# EAGLE design T4p0 (EAGLE 9.6.2)
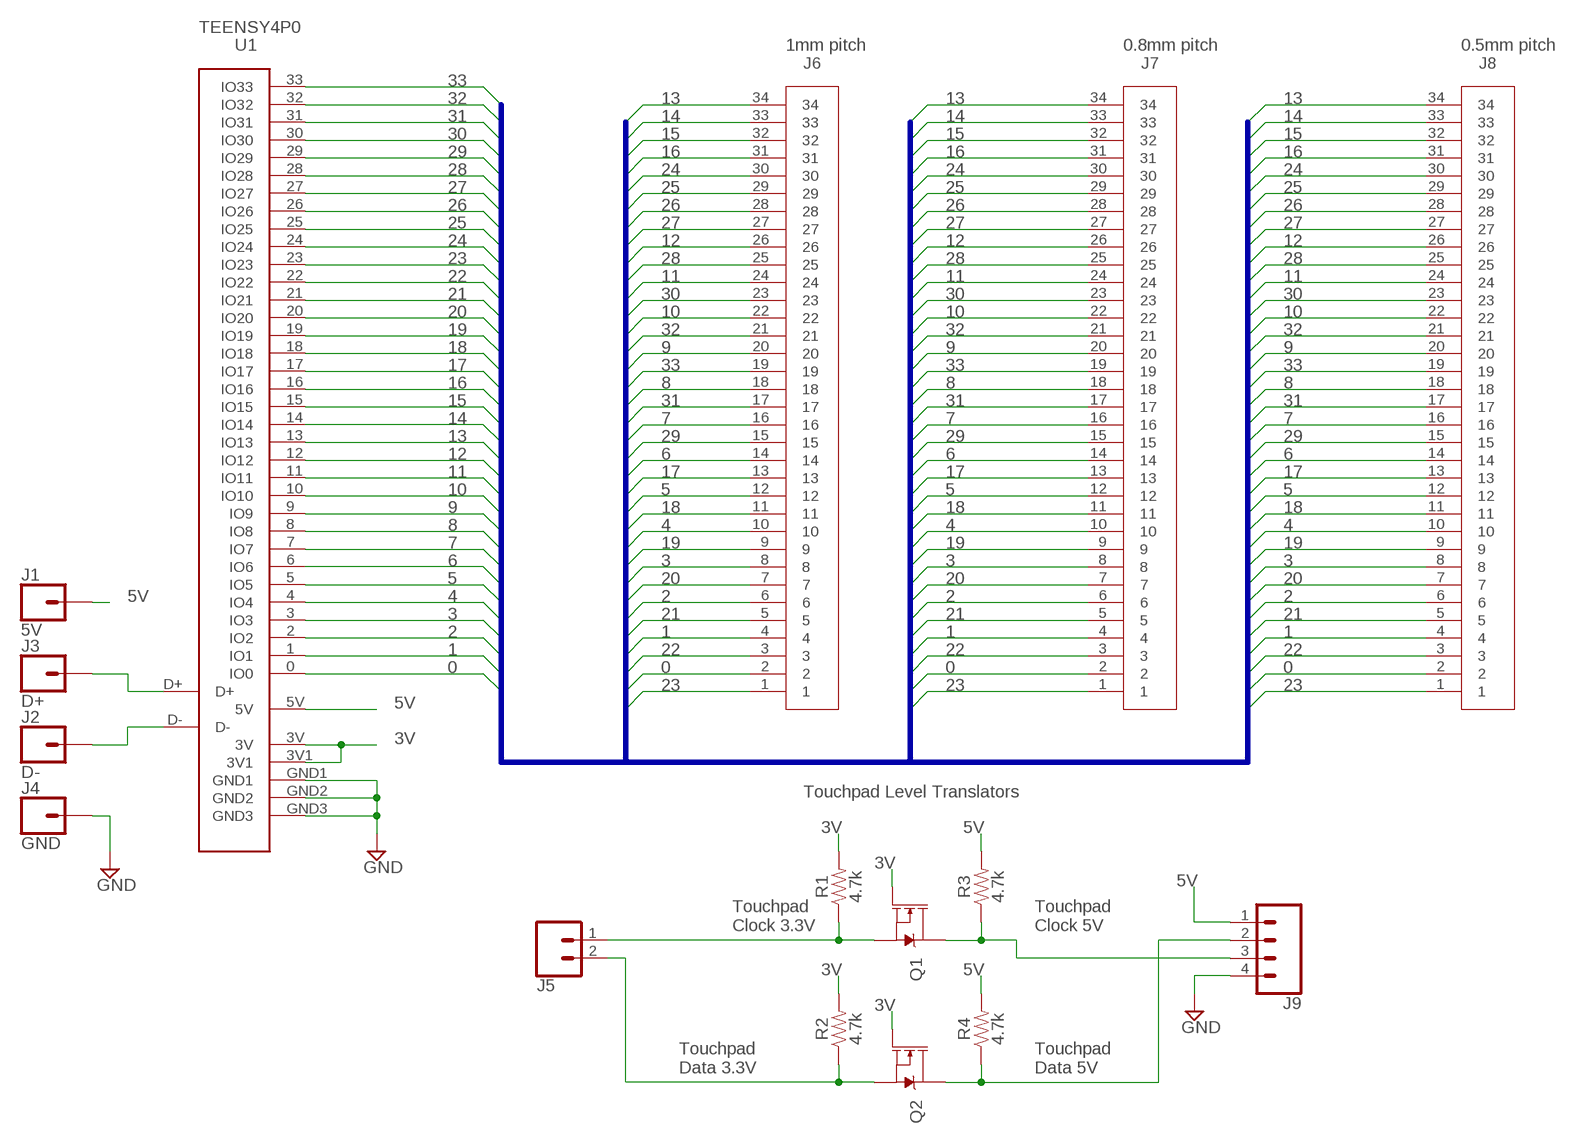
[diagram p0: schematic, sheet 1]

## Parts
J1  5V  CONN_01PTH_NO_SILK_YES_STOP  [1X01_NO_SILK]
J2  D-  CONN_01PTH_NO_SILK_YES_STOP  [1X01_NO_SILK]
J3  D+  CONN_01PTH_NO_SILK_YES_STOP  [1X01_NO_SILK]
J4  GND  CONN_01PTH_NO_SILK_YES_STOP  [1X01_NO_SILK]
J5  CONN_021X02_NO_SILK  [1X02_NO_SILK]
J6  FPC34  [FPC34]
J7  FPC34_P8MM  [FPC34_P8MM]
J8  FPC34_P5MM  [FPC34_P5MM]
J9  CONN_041X04_NO_SILK  [1X04_NO_SILK]
Q1  220mA/50V/3.5Ω  MOSFET-NCH-BSS138  [SOT23-3]
Q2  220mA/50V/3.5Ω  MOSFET-NCH-BSS138  [SOT23-3]
R1  4.7k  4.7KOHM-0603-1/10W-1%  [0603]
R2  4.7k  4.7KOHM-0603-1/10W-1%  [0603]
R3  4.7k  4.7KOHM-0603-1/10W-1%  [0603]
R4  4.7k  4.7KOHM-0603-1/10W-1%  [0603]
U1  TEENSY4P0  [TEENSY4P0]

## Nets
0: J6.2 J7.2 J8.2 U1.0(IO0)
1: J6.4 J7.4 J8.4 U1.1(IO1)
2: J6.6 J7.6 J8.6 U1.2(IO2)
3: J6.8 J7.8 J8.8 U1.3(IO3)
3V: Q1.1(G) Q2.1(G) R1.2 R2.2 U1.3V U1.3V1
4: J6.10 J7.10 J8.10 U1.4(IO4)
5: J6.12 J7.12 J8.12 U1.5(IO5)
5V: J1.1 J9.1 R3.2 R4.2 U1.5V
6: J6.14 J7.14 J8.14 U1.6(IO6)
7: J6.16 J7.16 J8.16 U1.7(IO7)
8: J6.18 J7.18 J8.18 U1.8(IO8)
9: J6.20 J7.20 J8.20 U1.9(IO9)
10: J6.22 J7.22 J8.22 U1.10(IO10)
11: J6.24 J7.24 J8.24 U1.11(IO11)
12: J6.26 J7.26 J8.26 U1.12(IO12)
13: J6.34 J7.34 J8.34 U1.13(IO13)
14: J6.33 J7.33 J8.33 U1.14(IO14)
15: J6.32 J7.32 J8.32 U1.15(IO15)
16: J6.31 J7.31 J8.31 U1.16(IO16)
17: J6.13 J7.13 J8.13 U1.17(IO17)
18: J6.11 J7.11 J8.11 U1.18(IO18)
19: J6.9 J7.9 J8.9 U1.19(IO19)
20: J6.7 J7.7 J8.7 U1.20(IO20)
21: J6.5 J7.5 J8.5 U1.21(IO21)
22: J6.3 J7.3 J8.3 U1.22(IO22)
23: J6.1 J7.1 J8.1 U1.23(IO23)
24: J6.30 J7.30 J8.30 U1.24(IO24)
25: J6.29 J7.29 J8.29 U1.25(IO25)
26: J6.28 J7.28 J8.28 U1.26(IO26)
27: J6.27 J7.27 J8.27 U1.27(IO27)
28: J6.25 J7.25 J8.25 U1.28(IO28)
29: J6.15 J7.15 J8.15 U1.29(IO29)
30: J6.23 J7.23 J8.23 U1.30(IO30)
31: J6.17 J7.17 J8.17 U1.31(IO31)
32: J6.21 J7.21 J8.21 U1.32(IO32)
33: J6.19 J7.19 J8.19 U1.33(IO33)
CLK3V: J5.1 Q1.2(S) R1.1
CLK5V: J9.3 Q1.3(D) R3.1
D+: J3.1 U1.D+
D-: J2.1 U1.D-
DATA3V: J5.2 Q2.2(S) R2.1
DATA5V: J9.2 Q2.3(D) R4.1
GND: J4.1 J9.4 U1.GND1 U1.GND2 U1.GND3

## Buses
IO:0,1,2,3,4,5,6,7,8,9,10,11,12,13,14,15,16,17,18,19,20,21,22,23,24,25,26,27,28,29,30,31,32,33,TPCLK,TPDATA

## Notes on the sheet
- 1mm pitch | 0.8mm pitch | 0.5mm pitch
- Touchpad Level Translators
- Touchpad
  Clock 3.3V
- Touchpad
  Clock 5V
- Touchpad
  Data 3.3V
- Touchpad
  Data 5V

## Library data of the parts
J1-J4 = SparkFun-Connectors:CONN_01: Single connection point. Often used as Generic Header-pin footprint for 0.1 inch spaced/style header connections On any of the 0.1 inch spaced packages, you can populate with these: Break Away Headers - Straight <https://www.sparkfun.com/products/116> (PRT-00116) Break Away Male Headers - Right Angle <https://www.sparkfun.com/products/553> (PRT-00553) Female Headers <https://www.sparkfun.com/products/115> (PRT-00115) Break Away Headers - Machine Pin <https://www.sparkfun.com/products/117> (PRT-00117) Break Away Female Headers - Swiss Machine Pin <https://www.sparkfun.com/products/743> (PRT-00743) This device is also useful as a general connection point to wire up your design to another part of your project. Our various solder wires solder well into these plated through hole pads. Hook-Up Wire - Assortment (Stranded, 22 AWG) <https://www.sparkfun.com/products/11375> (PRT-11375) Hook-Up Wire - Assortment (Solid Core, 22 AWG) <https://www.sparkfun.com/products/11367> (PRT-11367) View the entire wire category on our website here <https://www.sparkfun.com/categories/141> Special notes: SMTSO-256-ET is a "flush mount" nut for a 4-40 screw. We mostly use this on specialty testbeds; it is a nice way to connect hardware to your PCB at an adjustable hieght. Also note, the SNAP packages are for using a snappable style connector. We sell a baggie of snaps and they are also used on two LilyPad designs: Snap Assortment - 30 pack (male and female) <https://www.sparkfun.com/products/11347> (DEV-11347) LilyPad Arduino SimpleSnap <https://www.sparkfun.com/products/10941> (DEV-10941) LilyPad SimpleSnap Protoboard <https://www.sparkfun.com/products/10940> (DEV-10940)
J5 = SparkFun-Connectors:CONN_02: Multi connection point. Often used as Generic Header-pin footprint for 0.1 inch spaced/style header connections On any of the 0.1 inch spaced packages, you can populate with these: Break Away Headers - Straight <https://www.sparkfun.com/products/116> (PRT-00116) Break Away Male Headers - Right Angle <https://www.sparkfun.com/products/553> (PRT-00553) Female Headers <https://www.sparkfun.com/products/115> (PRT-00115) Break Away Headers - Machine Pin <https://www.sparkfun.com/products/117> (PRT-00117) Break Away Female Headers - Swiss Machine Pin <https://www.sparkfun.com/products/743> (PRT-00743) For SCREWTERMINALS and SPRING TERMINALS visit here: Screw Terimnals on SparkFun.com <https://www.sparkfun.com/search/results?term=Screw+Terminals> (5mm/3.5mm/2.54mm spacing) This device is also useful as a general connection point to wire up your design to another part of your project. Our various solder wires solder well into these plated through hole pads. Hook-Up Wire - Assortment (Stranded, 22 AWG) <https://www.sparkfun.com/products/11375> (PRT-11375) Hook-Up Wire - Assortment (Solid Core, 22 AWG) <https://www.sparkfun.com/products/11367> (PRT-11367) View the entire wire category on our website here <https://www.sparkfun.com/categories/141> Special notes: Molex polarized connector foot print use with: PRT-08233 with associated crimp pins and housings. 2.54_SCREWTERM for use with PRT-10571. 3.5mm Screw Terminal footprints for PRT-08084 5mm Screw Terminal footprints for use with PRT-08432
J6 = FPC34:FPC34: Molex Right Angle FPC Connector 1mm pitch, bottom contacts with 32 pins. Molex Part Number DigiKey Part Number
J7 = FPC34_p8mm:FPC34_P8MM: Molex Right Angle FPC Connector 1mm pitch, bottom contacts with 32 pins. Molex Part Number DigiKey Part Number
J8 = FPC34_p5mm:FPC34_P5MM: Molex Right Angle FPC Connector 1mm pitch, bottom contacts with 32 pins. Molex Part Number DigiKey Part Number
J9 = SparkFun-Connectors:CONN_04: Multi connection point. Often used as Generic Header-pin footprint for 0.1 inch spaced/style header connections On any of the 0.1 inch spaced packages, you can populate with these: Break Away Headers - Straight <https://www.sparkfun.com/products/116> (PRT-00116) Break Away Male Headers - Right Angle <https://www.sparkfun.com/products/553> (PRT-00553) Female Headers <https://www.sparkfun.com/products/115> (PRT-00115) Break Away Headers - Machine Pin <https://www.sparkfun.com/products/117> (PRT-00117) Break Away Female Headers - Swiss Machine Pin <https://www.sparkfun.com/products/743> (PRT-00743) For SCREWTERMINALS and SPRING TERMINALS visit here: Screw Terimnals on SparkFun.com <https://www.sparkfun.com/search/results?term=Screw+Terminals> (5mm/3.5mm/2.54mm spacing) This device is also useful as a general connection point to wire up your design to another part of your project. Our various solder wires solder well into these plated through hole pads. Hook-Up Wire - Assortment (Stranded, 22 AWG) <https://www.sparkfun.com/products/11375> (PRT-11375) Hook-Up Wire - Assortment (Solid Core, 22 AWG) <https://www.sparkfun.com/products/11367> (PRT-11367) View the entire wire category on our website here <https://www.sparkfun.com/categories/141> Special notes: Molex polarized connector foot print use with SKU : PRT-08231 with associated crimp pins and housings. 1MM SMD Version SKU: PRT-10208; PROD_ID: CONN-09696
Q1 Q2 = SparkFun-DiscreteSemi:MOSFET-NCH: N-channel MOSFETs Voltage controlled devices that allow control of high current outputs. SparkFun Products: SparkFun OpenScale <https://www.sparkfun.com/products/13261> SparkFun Digital Sandbox <https://www.sparkfun.com/products/12651> SparkFun Monster Moto Shield <https://www.sparkfun.com/products/10182> SparkFun MOSFET Power Controller <https://www.sparkfun.com/products/11214>; PROD_ID: TRANS-00830
R1-R4 = SparkFun-Resistors:4.7KOHM: 4.7kΩ resistor A resistor is a passive two-terminal electrical component that implements electrical resistance as a circuit element. Resistors act to reduce current flow, and, at the same time, act to lower voltage levels within circuits. - Wikipedia; PROD_ID: RES-07857
U1 = TEENSY4P0:TEENSY4P0

## Board
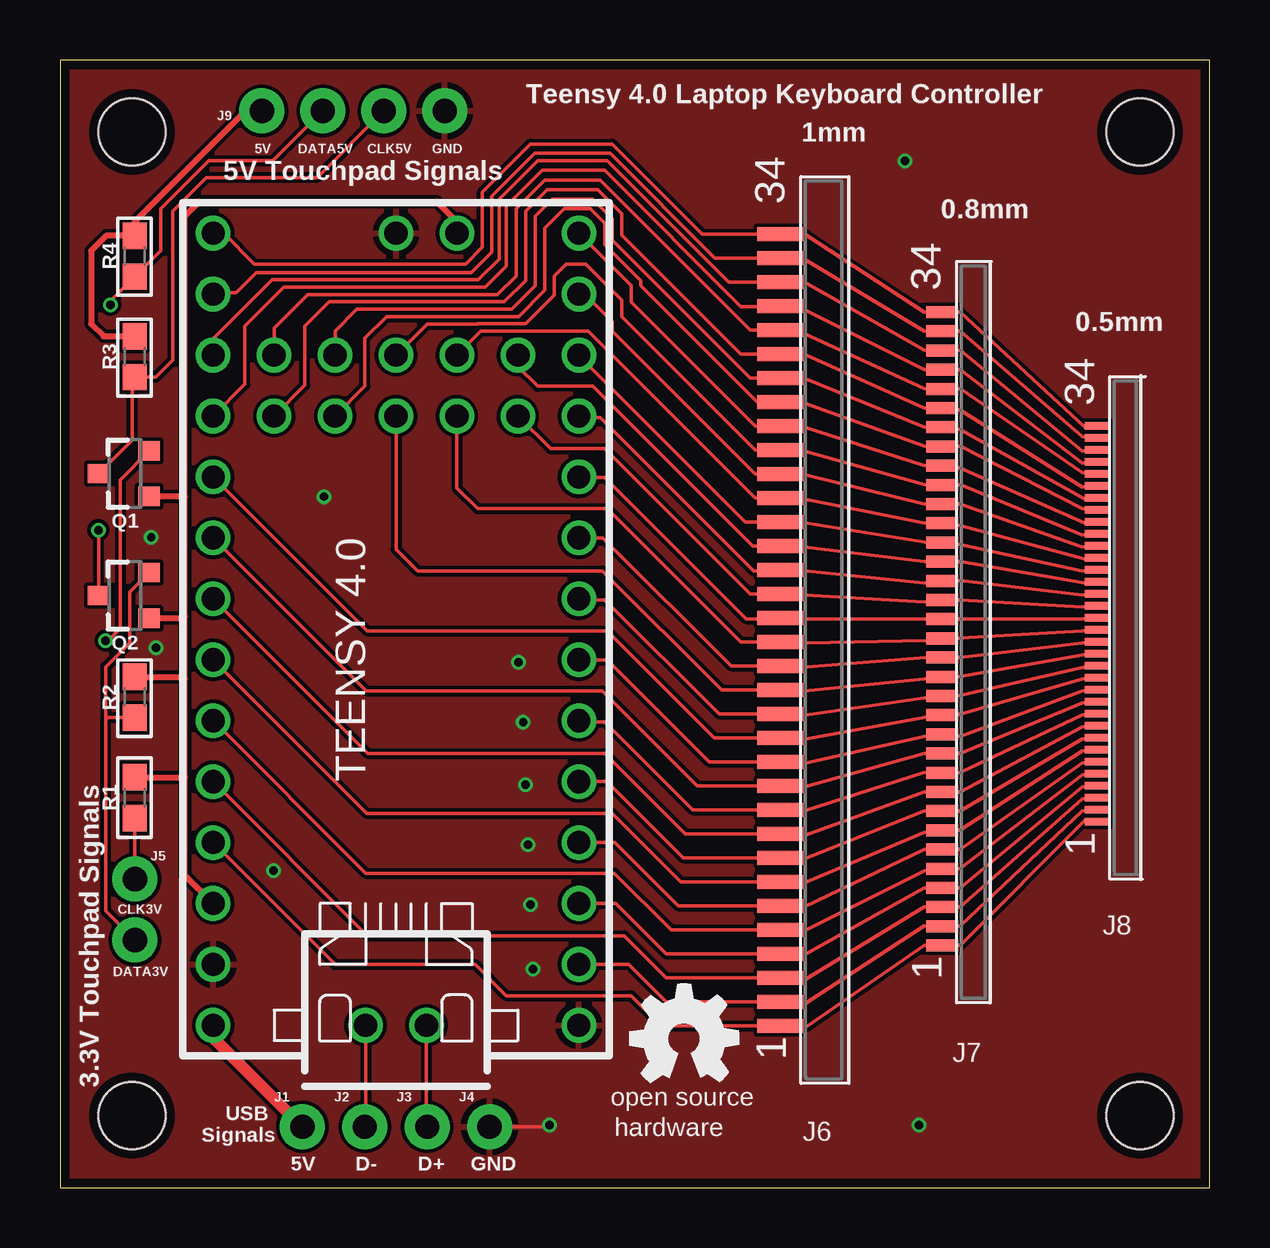
[diagram p1: board, top side]
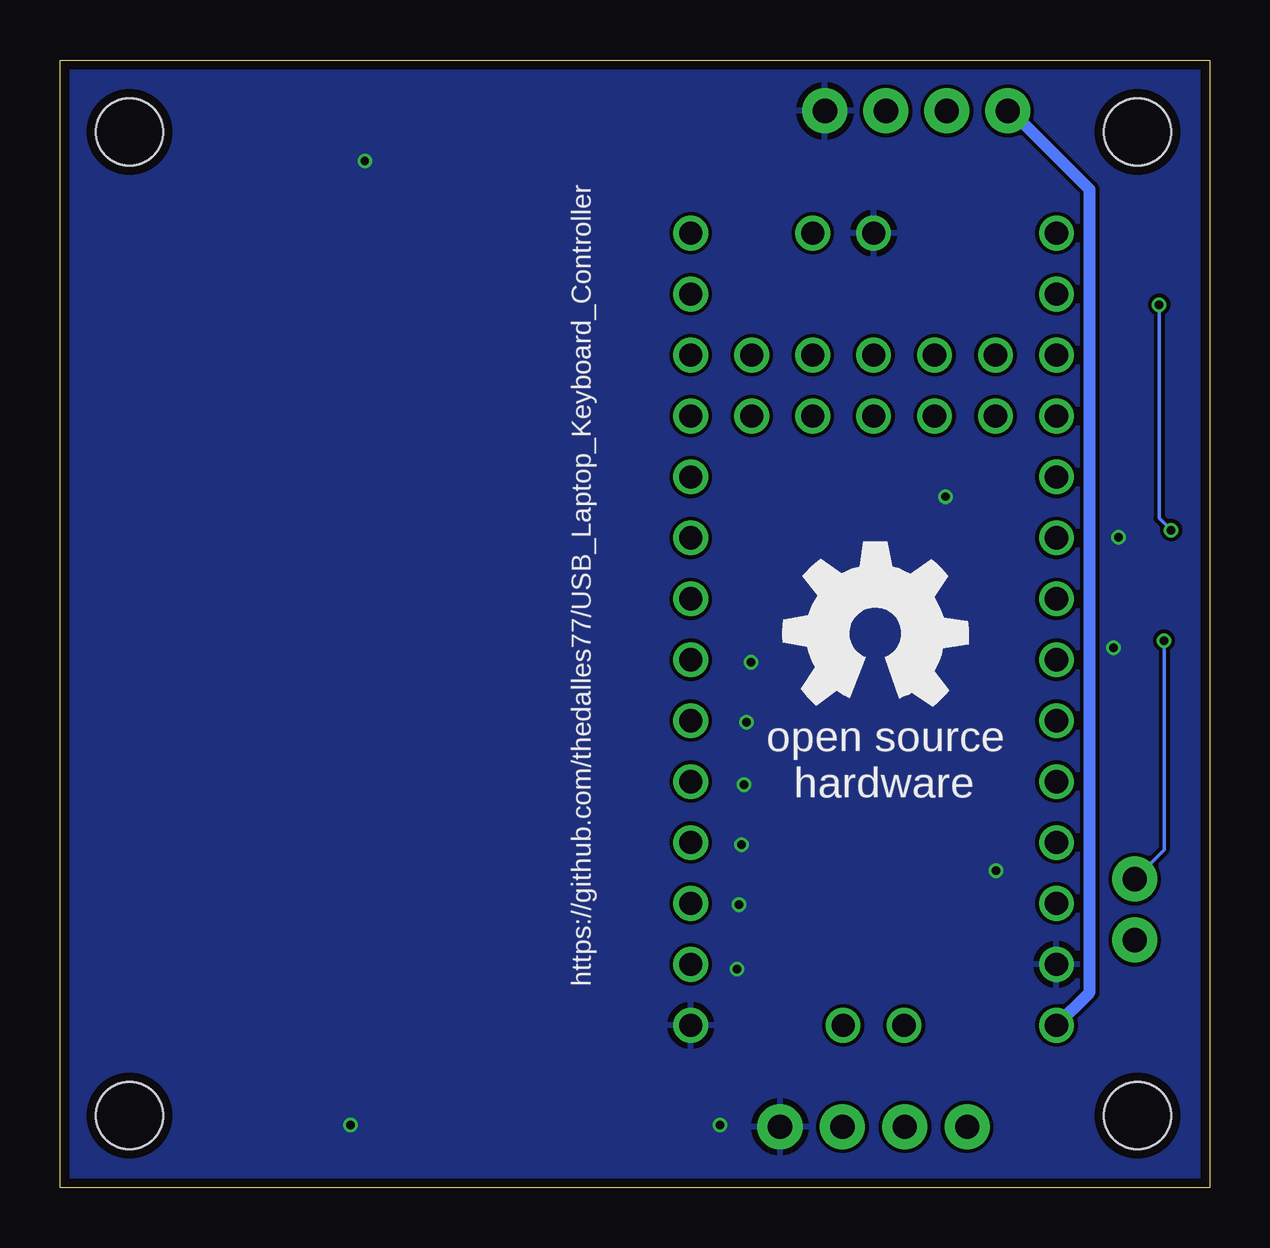
[diagram p2: board, bottom side, seen from below]

Size 47.9 x 47 mm. Coordinates in mm from the lower left corner, seen from the top.
Outline: 0,0 47.9,0 47.9,47 0,47 0,0
Copper layers (1*16): Top 0.035559375mm / dielectric 1.6mm / Bottom 0.035559375mm
Design rules "oshpark-2layer": minimum track width 6mil, minimum drill 10mil, track to track 6mil, track to pad 6mil, pad to pad 6mil, via to via 6mil, smd to smd 6mil, copper to edge 15mil, drill to drill 6mil, minimum pad ring 5mil, minimum via ring 5mil, stop-mask expansion 2.5mil, vias tented up to drill 0mil, thermal gap 10mil
Holes 2.8 mm at 3,3 3,44 45,44 45,3

### Footprints (pad centres in the part's own frame; a part is rotated, then mirrored left to right if it is on the bottom)
1X01_NO_SILK = drill 1.016 pad 1.88: 1 0,0
1X02_NO_SILK = drill 1.016 pad 1.88: 1 0,0; 2 2.54,0
FPC34 = smd 0.6 x 1.9: 1 -13.7,3.86; 2 -12.7,3.86; 3 -11.7,3.86; 4 -10.7,3.86; 5 -9.7,3.86; 6 -8.7,3.86; 7 -7.7,3.86; 8 -6.7,3.86; 9 -5.7,3.86; 10 -4.7,3.86; 11 -3.7,3.86; 12 -2.7,3.86; 13 -1.7,3.86; 14 -0.7,3.86; 15 0.3,3.86; 16 1.3,3.86; 17 2.3,3.86; 18 3.3,3.86; 19 4.3,3.86; 20 5.3,3.86; 21 6.3,3.86; 22 7.3,3.86; 23 8.3,3.86; 24 9.3,3.86; 25 10.3,3.86; 26 11.3,3.86; 27 12.3,3.86; 28 13.3,3.86; 29 14.3,3.86; 30 15.3,3.86; 31 16.3,3.86; 32 17.3,3.86; 33 18.3,3.86; 34 19.3,3.86
FPC34_P8MM = smd 0.5 x 1.35: 1 -13.7,3.6; 2 -12.9,3.6; 3 -12.1,3.6; 4 -11.3,3.6; 5 -10.5,3.6; 6 -9.7,3.6; 7 -8.9,3.6; 8 -8.1,3.6; 9 -7.3,3.6; 10 -6.5,3.6; 11 -5.7,3.6; 12 -4.9,3.6; 13 -4.1,3.6; 14 -3.3,3.6; 15 -2.5,3.6; 16 -1.7,3.6; 17 -0.9,3.6; 18 -0.1,3.6; 19 0.7,3.6; 20 1.5,3.6; 21 2.3,3.6; 22 3.1,3.6; 23 3.9,3.6; 24 4.7,3.6; 25 5.5,3.6; 26 6.3,3.6; 27 7.1,3.6; 28 7.9,3.6; 29 8.7,3.6; 30 9.5,3.6; 31 10.3,3.6; 32 11.1,3.6; 33 11.9,3.6; 34 12.7,3.6
FPC34_P5MM = smd 0.3 x 1.1: 1 -13.7,3.5; 2 -13.2,3.5; 3 -12.7,3.5; 4 -12.2,3.5; 5 -11.7,3.5; 6 -11.2,3.5; 7 -10.7,3.5; 8 -10.2,3.5; 9 -9.7,3.5; 10 -9.2,3.5; 11 -8.7,3.5; 12 -8.2,3.5; 13 -7.7,3.5; 14 -7.2,3.5; 15 -6.7,3.5; 16 -6.2,3.5; 17 -5.7,3.5; 18 -5.2,3.5; 19 -4.7,3.5; 20 -4.2,3.5; 21 -3.7,3.5; 22 -3.2,3.5; 23 -2.7,3.5; 24 -2.2,3.5; 25 -1.7,3.5; 26 -1.2,3.5; 27 -0.7,3.5; 28 -0.2,3.5; 29 0.3,3.5; 30 0.8,3.5; 31 1.3,3.5; 32 1.8,3.5; 33 2.3,3.5; 34 2.8,3.5
1X04_NO_SILK = drill 1.016 pad 1.88: 1 0,0; 2 2.54,0; 3 5.08,0; 4 7.62,0
SOT23-3 = smd 0.8 x 0.9: 1 -0.95,-1; 2 0.95,-1; 3 0,1.1
0603 = smd 1.1 x 1: 1 -0.85,0; 2 0.85,0
TEENSY4P0 = drill 0.965: 0 -12.7,-7.62; 1 -10.16,-7.62; 2 -7.62,-7.62; 3 -5.08,-7.62; 3V -10.16,7.62; 3V1 17.78,-2.54; 4 -2.54,-7.62; 5 0,-7.62; 5V -15.24,7.62; 6 2.54,-7.62; 7 5.08,-7.62; 8 7.62,-7.62; 9 10.16,-7.62; 10 12.7,-7.62; 11 15.24,-7.62; 12 17.78,-7.62; 13 17.78,7.62; 14 15.24,7.62; 15 12.7,7.62; 16 10.16,7.62; 17 7.62,7.62; 18 5.08,7.62; 19 2.54,7.62; 20 0,7.62; 21 -2.54,7.62; 22 -5.08,7.62; 23 -7.62,7.62; 24 12.7,5.08; 25 10.16,5.08; 26 12.7,2.54; 27 10.16,2.54; 28 12.7,0; 29 10.16,0; 30 12.7,-2.54; 31 10.16,-2.54; 32 12.7,-5.08; 33 10.16,-5.08; D+ -15.24,-1.27; D- -15.24,1.27; GND1 -15.24,-7.62; GND2 -12.7,7.62; GND3 17.78,0

### Placement (x,y rotation side)
J1  10.1,2.53 0 top
J2  12.7,2.53 0 top
J3  15.3,2.53 0 top
J4  17.9,2.53 0 top
J5  3.12,12.86 270 top
J6  33.87,20.44 90 top
J7  40.36,23.79 90 top
J8  46.74,28.95 90 top
J9  8.41,44.88 0 top
Q1  2.71,29.76 90 top
Q2  2.71,24.68 90 top
R1  3.12,16.25 90 top
R2  3.12,20.44 90 top
R3  3.12,34.63 90 top
R4  3.12,38.82 90 top
U1  14,22 90 top
U$1  [OSHW_5MM]  26,6.2 0 top
U$2  [OSHW_8MM]  13.9,23.1 0 top

### Tracks (layer width: path | path; a pad name or v marks a point on that pad's centre or on a via)
0
  Top 0.152: J6.2 30.1,7.74 | 30.1,7.74 31.1,7.7 36,10.9 J7.2 37.5,10.9 42.6,15.7 J8.2 | 30.1,7.74 25.26,7.74 23.7,9.3 U1.0
1
  Top 0.152: J8.4 42.6,16.7 37.5,12.5 J7.4 36,12.5 31,9.7 J6.4 25.26,9.74 23.16,11.84 U1.1
2
  Top 0.152: J8.6 42.6,17.7 37.5,14.1 J7.6 36,14.1 31,11.7 J6.6 25.76,11.74 23.12,14.38 U1.2
3
  Top 0.152: J8.8 42.6,18.7 37.5,15.7 J7.8 36,15.7 31,13.7 J6.8 25.96,13.74 22.78,16.92 U1.3
3V
  Top 0.254: U1.3V 5.2,13.02 5.2,17.1 | 5.2,17.1 5.2,21.2 | 5.2,21.2 5.2,23.8 | 5.2,23.8 5.2,28.8 | 5.2,28.8 5.19,28.81 Q1.1 | Q2.1 5.13,23.73 5.2,23.8 | R2.2 5.11,21.29 5.2,21.2 | R1.2 5.2,17.1 | 5.2,28.8 5.2,40.5 5.8,41.1 15.7,41.1 16.54,40.26 U1.3V1
4
  Top 0.152: J8.10 42.6,19.7 37.5,17.3 J7.10 36,17.3 31,15.7 J6.10 26.36,15.74 22.7,19.4 21.68,19.4 U1.4
5
  Top 0.152: J8.12 42.6,20.7 37.5,18.8 J7.12 36,18.8 31.1,17.7 J6.12 27.06,17.74 22.8,22 U1.5
5V
  Top 0.254: J9.1 7.73,44.88 3.12,40.27 R4.2 1.92,39.67 1.3,39.05 1.3,36 1.82,35.48 R3.2
  Top 0.508: J1.1 6.38,6.25 U1.5V
  Bottom 0.508: U1.5V 5,8.14 5,41.6 8.28,44.88 J9.1
6
  Top 0.152: J8.14 42.7,21.7 37.4,20.5 J7.14 36,20.4 31.1,19.7 J6.14 27.46,19.74 22.7,24.5 21.66,24.5 U1.6
7
  Top 0.152: J8.16 42.6,22.7 37.5,22.1 J7.16 36.1,22.1 31.1,21.7 J6.16 27.96,21.74 22.62,27.08 U1.7
8
  Top 0.152: J8.18 42.6,23.7 37.5,23.7 J7.18 36,23.7 31.1,23.7 J6.18 29.97,23.7 28.6,23.7 22.7,29.6 21.64,29.6 U1.8
9
  Top 0.152: J8.20 42.6,24.7 37.5,25.3 J7.20 36,25.2 31.1,25.7 J6.20 29.97,25.7 28.9,25.7 22.5,32.1 21.68,32.1 U1.9
10
  Top 0.152: J8.22 42.6,25.7 37.5,26.8 J7.22 36,26.9 31.1,27.7 J6.22 28.56,27.74 21.62,34.68 U1.10
11
  Top 0.152: J8.24 42.6,26.7 37.5,28.5 J7.24 36,28.5 31.1,29.7 J6.24 28.96,29.74 23,35.7 23,36.1 21.86,37.24 U1.11
12
  Top 0.152: J8.26 42.7,27.7 37.5,30 J7.26 36,30.1 31,31.7 J6.26 28.96,31.74 23.8,36.9 23.8,37.6 U1.12
13
  Top 0.152: J6.34 30.1,39.74 | 30.1,39.74 31.1,39.7 36,36.5 J7.34 37.5,36.5 42.7,31.7 J8.34 | U1.13 6.82,39.78 8.1,38.5 16.9,38.5 17.6,39.2 17.6,41.5 19.6,43.5 23,43.5 26.76,39.74 30.1,39.74
14
  Top 0.152: J8.33 42.6,31.3 37.5,35.7 J7.33 36,35.7 31,38.7 J6.33 27.29,38.74 22.93,43.1 19.77,43.1 17.99,41.32 17.99,38.99 17.14,38.14 8.18,38.14 7.35,37.31 6.45,37.31 U1.14
15
  Top 0.152: J8.32 42.6,30.7 37.5,34.9 J7.32 36,34.9 31.1,37.7 31.06,37.74 J6.32 27.87,37.73 22.8,42.8 19.9,42.8 18.3,41.2 18.3,41.03 18.3,38.7 17.43,37.83 8.83,37.83 6.38,35.38 U1.15
16
  Top 0.152: J6.31 30.1,36.73 | 30.1,36.73 31,36.6 36,34.1 J7.31 37.5,34.1 42.6,30.2 J8.31 | U1.16 7.7,33.48 7.7,35.9 9.33,37.53 17.73,37.53 18.6,38.4 18.6,40.9 20.1,42.4 22.7,42.4 28.37,36.73 30.1,36.73
17
  Top 0.152: J6.13 30.1,18.74 | 30.1,18.74 31.1,18.7 36,19.6 J7.13 37.4,19.7 42.6,21.2 J8.13 | U1.17 12.8,23.2 22.8,23.2 27.26,18.74 30.1,18.74
18
  Top 0.152: J8.11 42.6,20.2 37.5,18.1 J7.11 36,18.1 31,16.7 J6.11 26.56,16.74 22.6,20.7 12.76,20.7 U1.18
19
  Top 0.152: J8.9 42.6,19.2 37.5,16.5 J7.9 36,16.5 31.1,14.7 J6.9 26.06,14.74 22.7,18.1 12.82,18.1 U1.19
20
  Top 0.152: J8.7 42.6,18.2 37.5,14.9 J7.7 36,14.8 31,12.7 J6.7 25.86,12.74 23,15.6 12.78,15.6 U1.20
21
  Top 0.152: J8.5 42.6,17.2 37.5,13.3 J7.5 36,13.2 31,10.7 J6.5 25.46,10.74 23.1,13.1 12.74,13.1 U1.21
22
  Top 0.152: J8.3 42.6,16.2 37.5,11.7 J7.3 36,11.7 31.1,8.7 J6.3 25.26,8.74 23.5,10.5 12.8,10.5 U1.22
23
  Top 0.152: J8.1 42.7,15.3 37.5,10.1 J7.1 36,10.1 31.1,6.7 J6.1 25.06,6.74 23.8,8 18.6,8 17.3,9.3 11.46,9.3 U1.23
24
  Top 0.152: J8.30 42.6,29.8 37.5,33.3 J7.30 36,33.3 31,35.6 J6.30 28.76,35.74 22.5,42 20.2,42 19,40.8 19,38 18.22,37.22 10.32,37.22 8.92,35.82 U1.24
25
  Top 0.152: J8.29 42.6,29.2 37.5,32.4 J7.29 36,32.5 31.1,34.7 J6.29 28.36,34.74 23.4,39.7 23.4,40.6 22.4,41.6 20.3,41.6 19.4,40.7 19.4,37.8 18.52,36.92 11.22,36.92 10.2,35.9 10.2,33.44 U1.25
26
  Top 0.152: J8.28 42.7,28.7 37.5,31.6 J7.28 36,31.7 31.1,33.7 J6.28 28.76,33.74 23,39.49 23,40.4 22.2,41.2 20.5,41.2 19.8,40.5 19.8,37.6 18.81,36.61 12.37,36.61 11.46,35.7 U1.26
27
  Top 0.152: J8.27 42.6,28.3 37.5,30.9 J7.27 36,30.9 31,32.7 J6.27 29.97,32.7 29.1,32.7 24.2,37.6 24.2,37.8 22.7,39.3 22.7,40.2 22.1,40.8 21,40.8 20.2,40 20.2,37.4 19.11,36.31 13.61,36.31 12.7,35.4 12.7,33.4 U1.27
28
  Top 0.152: J6.25 30.1,30.74 | 30.1,30.74 31,30.7 36,29.3 J7.25 37.5,29.3 42.6,27.2 J8.25 | U1.28 15.3,36 17.41,36 17.41,36.01 19.41,36.01 20.6,37.2 20.6,38 21.1,38.5 21.9,38.5 23.4,37 23.4,36.3 28.96,30.74 30.1,30.74
29
  Top 0.152: J6.15 30.2,20.73 | 30.2,20.73 31,20.7 36,21.2 J7.15 37.5,21.3 42.6,22.2 J8.15 | U1.29 14,26.6 14.9,25.7 22.6,25.7 27.57,20.73 30.2,20.73
30
  Top 0.152: J8.23 42.7,26.2 37.5,27.6 J7.23 36,27.7 31,28.7 J6.23 28.96,28.74 22,35.7 17.54,35.7 U1.30
31
  Top 0.152: J8.17 42.6,23.2 37.5,22.9 J7.17 36.1,22.8 31.1,22.7 J6.17 28.36,22.74 22.8,28.3 17.4,28.3 16.54,29.16 U1.31
32
  Top 0.152: J8.21 42.7,25.2 37.5,26.1 J7.21 36,26.1 31,26.7 J6.21 28.86,26.74 22.2,33.4 19.9,33.4 19.08,34.22 U1.32
33
  Top 0.152: J8.19 42.6,24.2 37.5,24.5 J7.19 36,24.4 31,24.7 J6.19 28.76,24.74 22.7,30.8 20.44,30.8 U1.33
CLK3V  (via drill 0.35)
  Top 0.152: J5.1 R1.1 | Q1.2 2.5,29.5 2.5,23.3 2,22.8 v1.9,22.8
  Bottom 0.152: v1.9,22.8 1.9,14.08 J5.1
CLK5V
  Top 0.152: Q1.3 3,31.15 3,33.66 R3.1 3.98,33.78 4.7,34.5 4.7,40.7 6.1,42.1 10.71,42.1 J9.3
D+
  Top 0.152: U1.D+ 15.27,2.56 J3.1
D-
  Top 0.152: U1.D- 12.73,2.56 J2.1
DATA3V
  Top 0.152: J5.2 1.9,11.54 1.9,19.5 | R2.1 1.99,19.59 1.9,19.5 | Q2.2 2.9,24.82 2.9,22.7 1.9,21.7 1.9,19.5
DATA5V  (via drill 0.35)
  Top 0.152: Q2.3 1.61,27.29 1.6,27.3 v1.6,27.4 | v2.1,36.8 2.1,36.95 R4.1 4.2,39.05 4.2,40.8 6.2,42.8 8.87,42.8 J9.2
  Bottom 0.152: v1.6,27.4 2.1,27.9 v2.1,36.8
GND  (via drill 0.35)
  Top 0.152: J4.1 20.33,2.53 v20.4,2.6
  other vias: 35.8,2.6 35.2,42.8 11,28.8 19.1,21.9 19.3,19.4 19.4,16.8 19.5,14.3 19.6,11.8 19.7,9.1 8.9,13.2 3.8,27.1 4,22.5
  pour Top: 0,0 0,46.9 48,46.9 48,0
  pour Bottom: 0,0 0,47 48,47 48,0

### Text on the board
tPlace: Teensy 4.0 Laptop Keyboard Controller | 1mm | 5V | DATA5V | CLK5V | GND | 5V Touchpad Signals | 34 | 0.8mm | 34 | 0.5mm | 34 | 3.3V Touchpad Signals | CLK3V | DATA3V | USB | Signals | 5V | D- | D+ | GND
bPlace: https://github.com/thedalles77/USB_Laptop_Keyboard_Controller